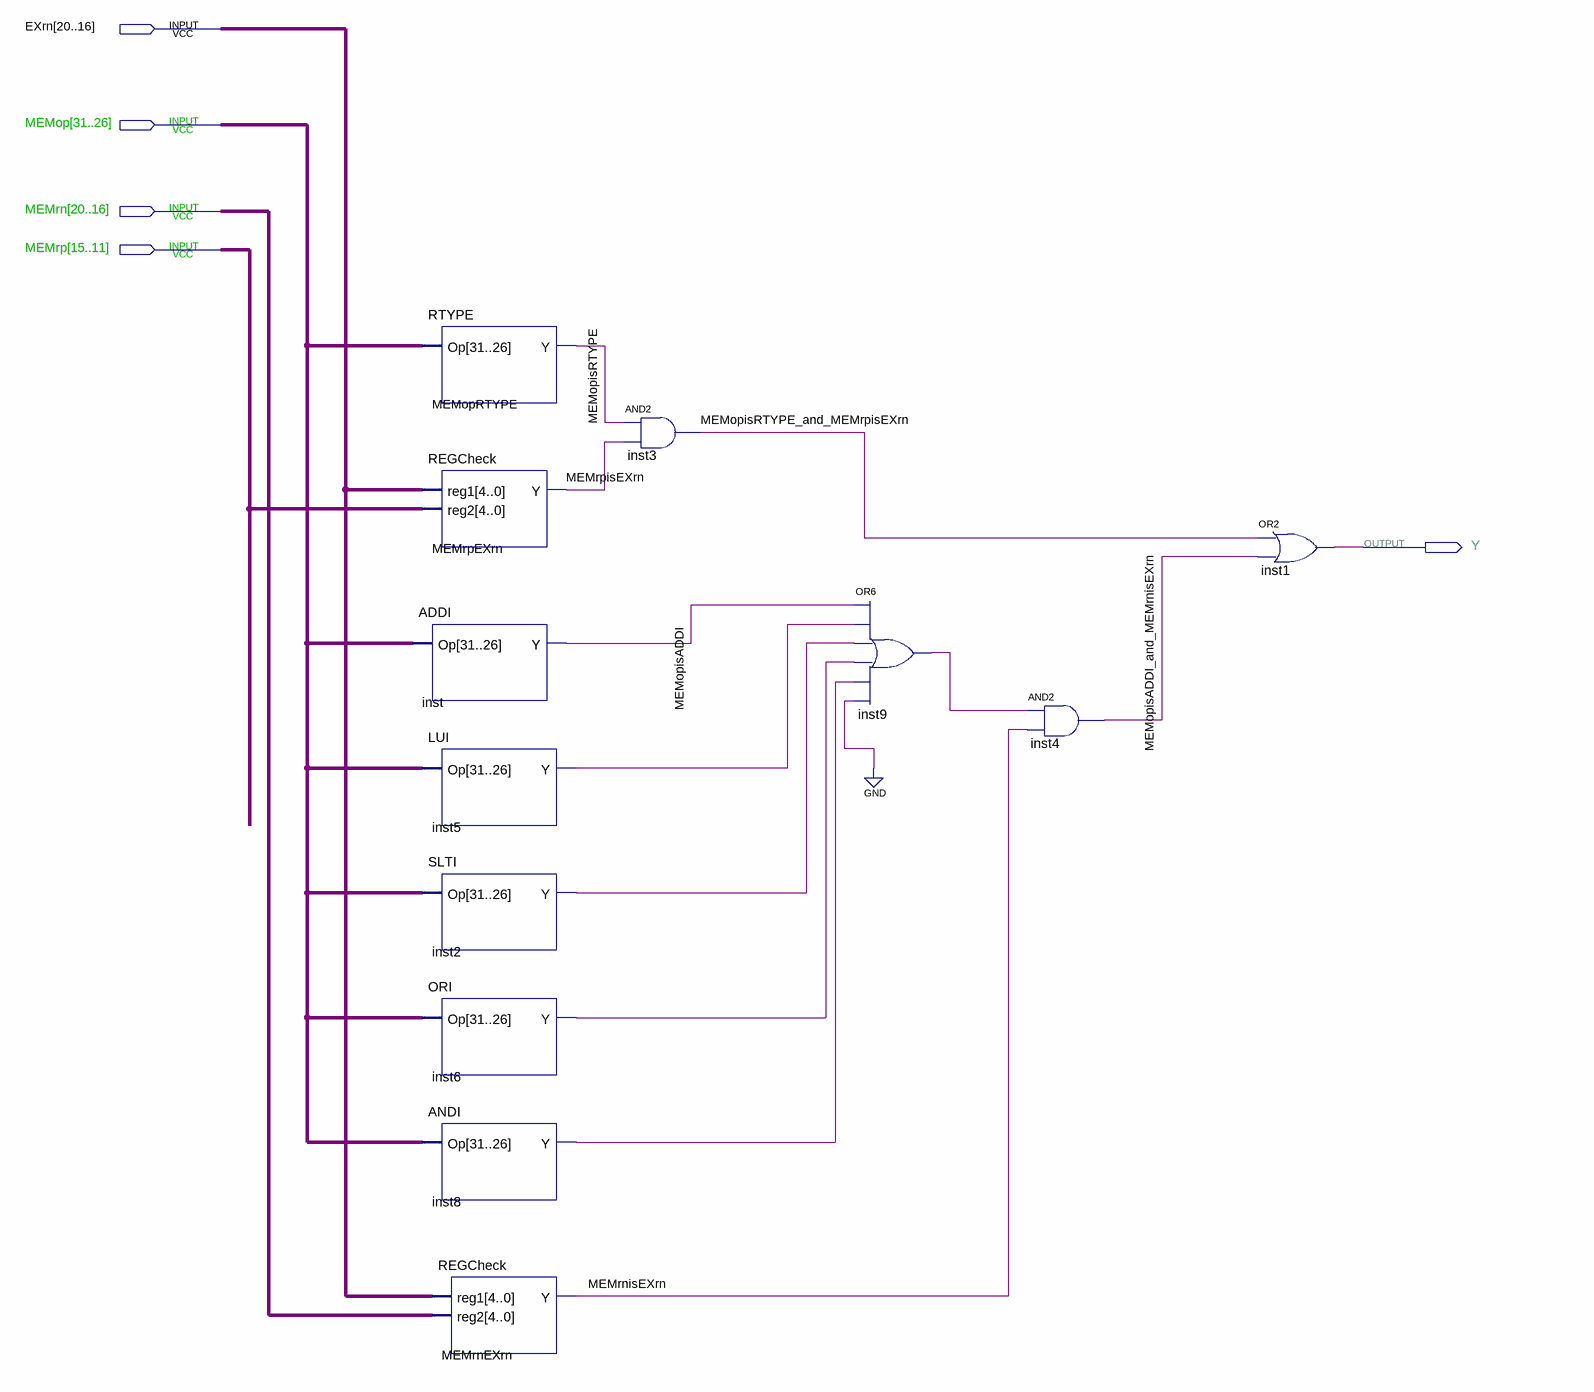
[diagram p0: schematic sheet]
// Quartus schematic ForwardBfromMEMtoEX.bdf as structural Verilog: 12 symbols, 5 pins
module ForwardBfromMEMtoEX (
  input  [20:16] EXrn,
  input  [31:26] MEMop,
  input  [20:16] MEMrn,
  input  [15:11] MEMrp,
  output Y
);

  wire inst2_y, inst5_y, inst6_y, inst8_y, inst9_out, MEMopisADDI, MEMopisADDI_and_MEMrnisEXrn, MEMopisRTYPE,
       MEMopisRTYPE_and_MEMrpisEXrn, MEMrnisEXrn, MEMrpisEXrn;

  RTYPE MEMopRTYPE (.Op(MEMop), .Y(MEMopisRTYPE));
  REGCheck MEMrpEXrn (.reg1(EXrn), .reg2(MEMrp), .Y(MEMrpisEXrn));
  ADDI inst (.Op(MEMop), .Y(MEMopisADDI));
  LUI inst5 (.Op(MEMop), .Y(inst5_y));
  SLTI inst2 (.Op(MEMop), .Y(inst2_y));
  ORI inst6 (.Op(MEMop), .Y(inst6_y));
  ANDI inst8 (.Op(MEMop), .Y(inst8_y));
  REGCheck MEMrnEXrn (.reg1(EXrn), .reg2(MEMrn), .Y(MEMrnisEXrn));
  and inst3 (MEMopisRTYPE_and_MEMrpisEXrn, MEMopisRTYPE, MEMrpisEXrn);
  or inst9 (inst9_out, MEMopisADDI, inst5_y, inst2_y, inst6_y, inst8_y, 1'b0);
  and inst4 (MEMopisADDI_and_MEMrnisEXrn, inst9_out, MEMrnisEXrn);
  or inst1 (Y, MEMopisRTYPE_and_MEMrpisEXrn, MEMopisADDI_and_MEMrnisEXrn);
endmodule
